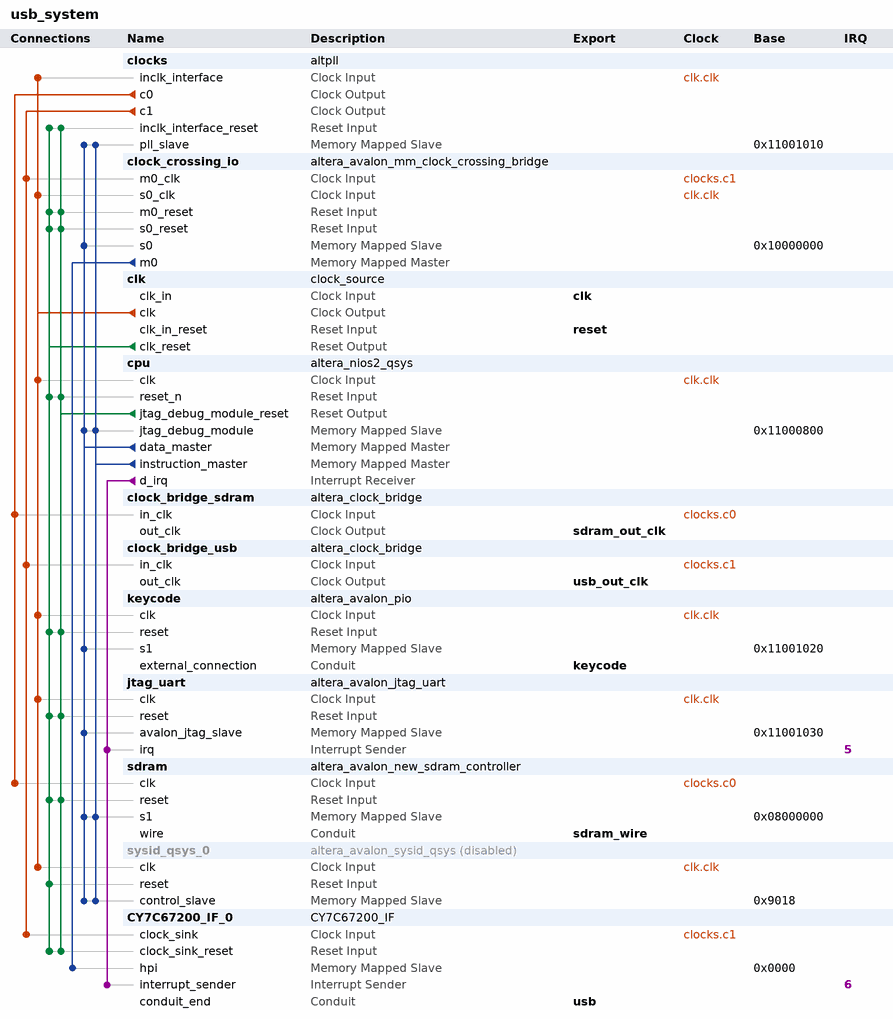
[diagram p0: system contents]
# Platform Designer (Qsys) system usb_system, Cyclone IV E EP4CE115F29C7
# Parameters at their usual value, and those the tool derives, are not listed.
package require -exact qsys 14.0
create_system usb_system
set_project_property DEVICE_FAMILY {Cyclone IV E}
set_project_property DEVICE EP4CE115F29C7

add_instance clocks altpll 14.0
set_instance_parameter_value clocks INCLK0_INPUT_FREQUENCY 20000
set_instance_parameter_value clocks CLK0_MULTIPLY_BY 1
set_instance_parameter_value clocks CLK1_MULTIPLY_BY 1
set_instance_parameter_value clocks CLK0_DIVIDE_BY 1
set_instance_parameter_value clocks CLK1_DIVIDE_BY 5
set_instance_parameter_value clocks CLK0_PHASE_SHIFT -3000
set_instance_parameter_value clocks CLK1_PHASE_SHIFT 0
set_instance_parameter_value clocks CLK1_DUTY_CYCLE 50
set_instance_parameter_value clocks PORT_clk1 PORT_USED
set_instance_parameter_value clocks PORT_clk2 PORT_UNUSED
set_instance_parameter_value clocks PORT_clk3 PORT_UNUSED
set_instance_parameter_value clocks PORT_ARESET PORT_UNUSED
set_instance_parameter_value clocks PORT_LOCKED PORT_UNUSED

add_instance clock_crossing_io altera_avalon_mm_clock_crossing_bridge 14.0
set_instance_parameter_value clock_crossing_io DATA_WIDTH 32
set_instance_parameter_value clock_crossing_io ADDRESS_WIDTH 22
set_instance_parameter_value clock_crossing_io USE_AUTO_ADDRESS_WIDTH 0
set_instance_parameter_value clock_crossing_io MAX_BURST_SIZE 1
set_instance_parameter_value clock_crossing_io COMMAND_FIFO_DEPTH 32
set_instance_parameter_value clock_crossing_io RESPONSE_FIFO_DEPTH 256
set_instance_parameter_value clock_crossing_io MASTER_SYNC_DEPTH 3
set_instance_parameter_value clock_crossing_io SLAVE_SYNC_DEPTH 3

add_instance clk clock_source 14.0
set_instance_parameter_value clk clockFrequency 50000000

add_instance cpu altera_nios2_qsys 14.0
set_instance_parameter_value cpu manuallyAssignCpuID false
set_instance_parameter_value cpu resetrequest_enabled true
set_instance_parameter_value cpu resetSlave sdram.s1
set_instance_parameter_value cpu mmu_TLBMissExcSlave None
set_instance_parameter_value cpu exceptionSlave sdram.s1
set_instance_parameter_value cpu breakSlave cpu.jtag_debug_module
set_instance_parameter_value cpu impl Tiny
set_instance_parameter_value cpu icache_size 4096

add_instance clock_bridge_sdram altera_clock_bridge 14.0
set_instance_parameter_value clock_bridge_sdram DERIVED_CLOCK_RATE 50000000
set_instance_parameter_value clock_bridge_sdram EXPLICIT_CLOCK_RATE 0

add_instance clock_bridge_usb altera_clock_bridge 14.0
set_instance_parameter_value clock_bridge_usb DERIVED_CLOCK_RATE 10000000
set_instance_parameter_value clock_bridge_usb EXPLICIT_CLOCK_RATE 0

add_instance keycode altera_avalon_pio 14.0
set_instance_parameter_value keycode direction Output
set_instance_parameter_value keycode width 8

add_instance jtag_uart altera_avalon_jtag_uart 14.0
set_instance_parameter_value jtag_uart simInteractiveOptions NO_INTERACTIVE_WINDOWS

add_instance sdram altera_avalon_new_sdram_controller 14.0
set_instance_parameter_value sdram TAC 5.5
set_instance_parameter_value sdram TRCD 20.0
set_instance_parameter_value sdram TRP 20.0
set_instance_parameter_value sdram casLatency 3
set_instance_parameter_value sdram columnWidth 10
set_instance_parameter_value sdram dataWidth 32
set_instance_parameter_value sdram generateSimulationModel false
set_instance_parameter_value sdram model single_Micron_MT48LC4M32B2_7_chip
set_instance_parameter_value sdram numberOfBanks 4
set_instance_parameter_value sdram numberOfChipSelects 1
set_instance_parameter_value sdram powerUpDelay 200.0
set_instance_parameter_value sdram refreshPeriod 7.8125
set_instance_parameter_value sdram rowWidth 13

add_instance sysid_qsys_0 altera_avalon_sysid_qsys 14.0
set_instance_property sysid_qsys_0 ENABLED false
set_instance_parameter_value sysid_qsys_0 id 0

add_instance CY7C67200_IF_0 CY7C67200_IF 1.0

# connections
add_connection clk.clk clock_crossing_io.s0_clk clock
add_connection clk.clk clocks.inclk_interface clock
add_connection clk.clk cpu.clk clock
add_connection clk.clk jtag_uart.clk clock
add_connection clk.clk keycode.clk clock
add_connection clk.clk sysid_qsys_0.clk clock
add_connection clocks.c0 clock_bridge_sdram.in_clk clock
add_connection clocks.c0 sdram.clk clock
add_connection clocks.c1 clock_bridge_usb.in_clk clock
add_connection clocks.c1 clock_crossing_io.m0_clk clock
add_connection clocks.c1 CY7C67200_IF_0.clock_sink clock
add_connection clk.clk_reset clock_crossing_io.m0_reset reset
add_connection clk.clk_reset clock_crossing_io.s0_reset reset
add_connection clk.clk_reset clocks.inclk_interface_reset reset
add_connection clk.clk_reset cpu.reset_n reset
add_connection clk.clk_reset CY7C67200_IF_0.clock_sink_reset reset
add_connection clk.clk_reset jtag_uart.reset reset
add_connection clk.clk_reset keycode.reset reset
add_connection clk.clk_reset sdram.reset reset
add_connection clk.clk_reset sysid_qsys_0.reset reset
add_connection cpu.jtag_debug_module_reset clock_crossing_io.m0_reset reset
add_connection cpu.jtag_debug_module_reset clock_crossing_io.s0_reset reset
add_connection cpu.jtag_debug_module_reset clocks.inclk_interface_reset reset
add_connection cpu.jtag_debug_module_reset cpu.reset_n reset
add_connection cpu.jtag_debug_module_reset CY7C67200_IF_0.clock_sink_reset reset
add_connection cpu.jtag_debug_module_reset jtag_uart.reset reset
add_connection cpu.jtag_debug_module_reset keycode.reset reset
add_connection cpu.jtag_debug_module_reset sdram.reset reset
add_connection clock_crossing_io.m0 CY7C67200_IF_0.hpi avalon
set_connection_parameter_value clock_crossing_io.m0/CY7C67200_IF_0.hpi baseAddress 0x0000
add_connection cpu.data_master clock_crossing_io.s0 avalon
set_connection_parameter_value cpu.data_master/clock_crossing_io.s0 baseAddress 0x10000000
add_connection cpu.data_master clocks.pll_slave avalon
set_connection_parameter_value cpu.data_master/clocks.pll_slave baseAddress 0x11001010
add_connection cpu.data_master cpu.jtag_debug_module avalon
set_connection_parameter_value cpu.data_master/cpu.jtag_debug_module baseAddress 0x11000800
add_connection cpu.data_master jtag_uart.avalon_jtag_slave avalon
set_connection_parameter_value cpu.data_master/jtag_uart.avalon_jtag_slave baseAddress 0x11001030
add_connection cpu.data_master keycode.s1 avalon
set_connection_parameter_value cpu.data_master/keycode.s1 baseAddress 0x11001020
add_connection cpu.data_master sdram.s1 avalon
set_connection_parameter_value cpu.data_master/sdram.s1 baseAddress 0x08000000
add_connection cpu.data_master sysid_qsys_0.control_slave avalon
set_connection_parameter_value cpu.data_master/sysid_qsys_0.control_slave baseAddress 0x9018
add_connection cpu.instruction_master clocks.pll_slave avalon
set_connection_parameter_value cpu.instruction_master/clocks.pll_slave baseAddress 0x11001010
add_connection cpu.instruction_master cpu.jtag_debug_module avalon
set_connection_parameter_value cpu.instruction_master/cpu.jtag_debug_module baseAddress 0x11000800
add_connection cpu.instruction_master sdram.s1 avalon
set_connection_parameter_value cpu.instruction_master/sdram.s1 baseAddress 0x08000000
add_connection cpu.instruction_master sysid_qsys_0.control_slave avalon
set_connection_parameter_value cpu.instruction_master/sysid_qsys_0.control_slave baseAddress 0x9018
add_connection cpu.d_irq CY7C67200_IF_0.interrupt_sender interrupt
set_connection_parameter_value cpu.d_irq/CY7C67200_IF_0.interrupt_sender irqNumber 6
add_connection cpu.d_irq jtag_uart.irq interrupt
set_connection_parameter_value cpu.d_irq/jtag_uart.irq irqNumber 5

# exported interfaces
add_interface clk clock sink
set_interface_property clk EXPORT_OF clk.clk_in
add_interface reset reset sink
set_interface_property reset EXPORT_OF clk.clk_in_reset
add_interface sdram_wire conduit end
set_interface_property sdram_wire EXPORT_OF sdram.wire
add_interface keycode conduit end
set_interface_property keycode EXPORT_OF keycode.external_connection
add_interface usb conduit end
set_interface_property usb EXPORT_OF CY7C67200_IF_0.conduit_end
add_interface sdram_out_clk clock source
set_interface_property sdram_out_clk EXPORT_OF clock_bridge_sdram.out_clk
add_interface usb_out_clk clock source
set_interface_property usb_out_clk EXPORT_OF clock_bridge_usb.out_clk

set_interconnect_requirement {$system} qsys_mm.clockCrossingAdapter HANDSHAKE
set_interconnect_requirement {$system} qsys_mm.maxAdditionalLatency 1
set_interconnect_requirement {$system} qsys_mm.insertDefaultSlave FALSE

save_system usb_system.qsys
